# EAGLE schematic schematic_v2 (EAGLE 9.6.2)
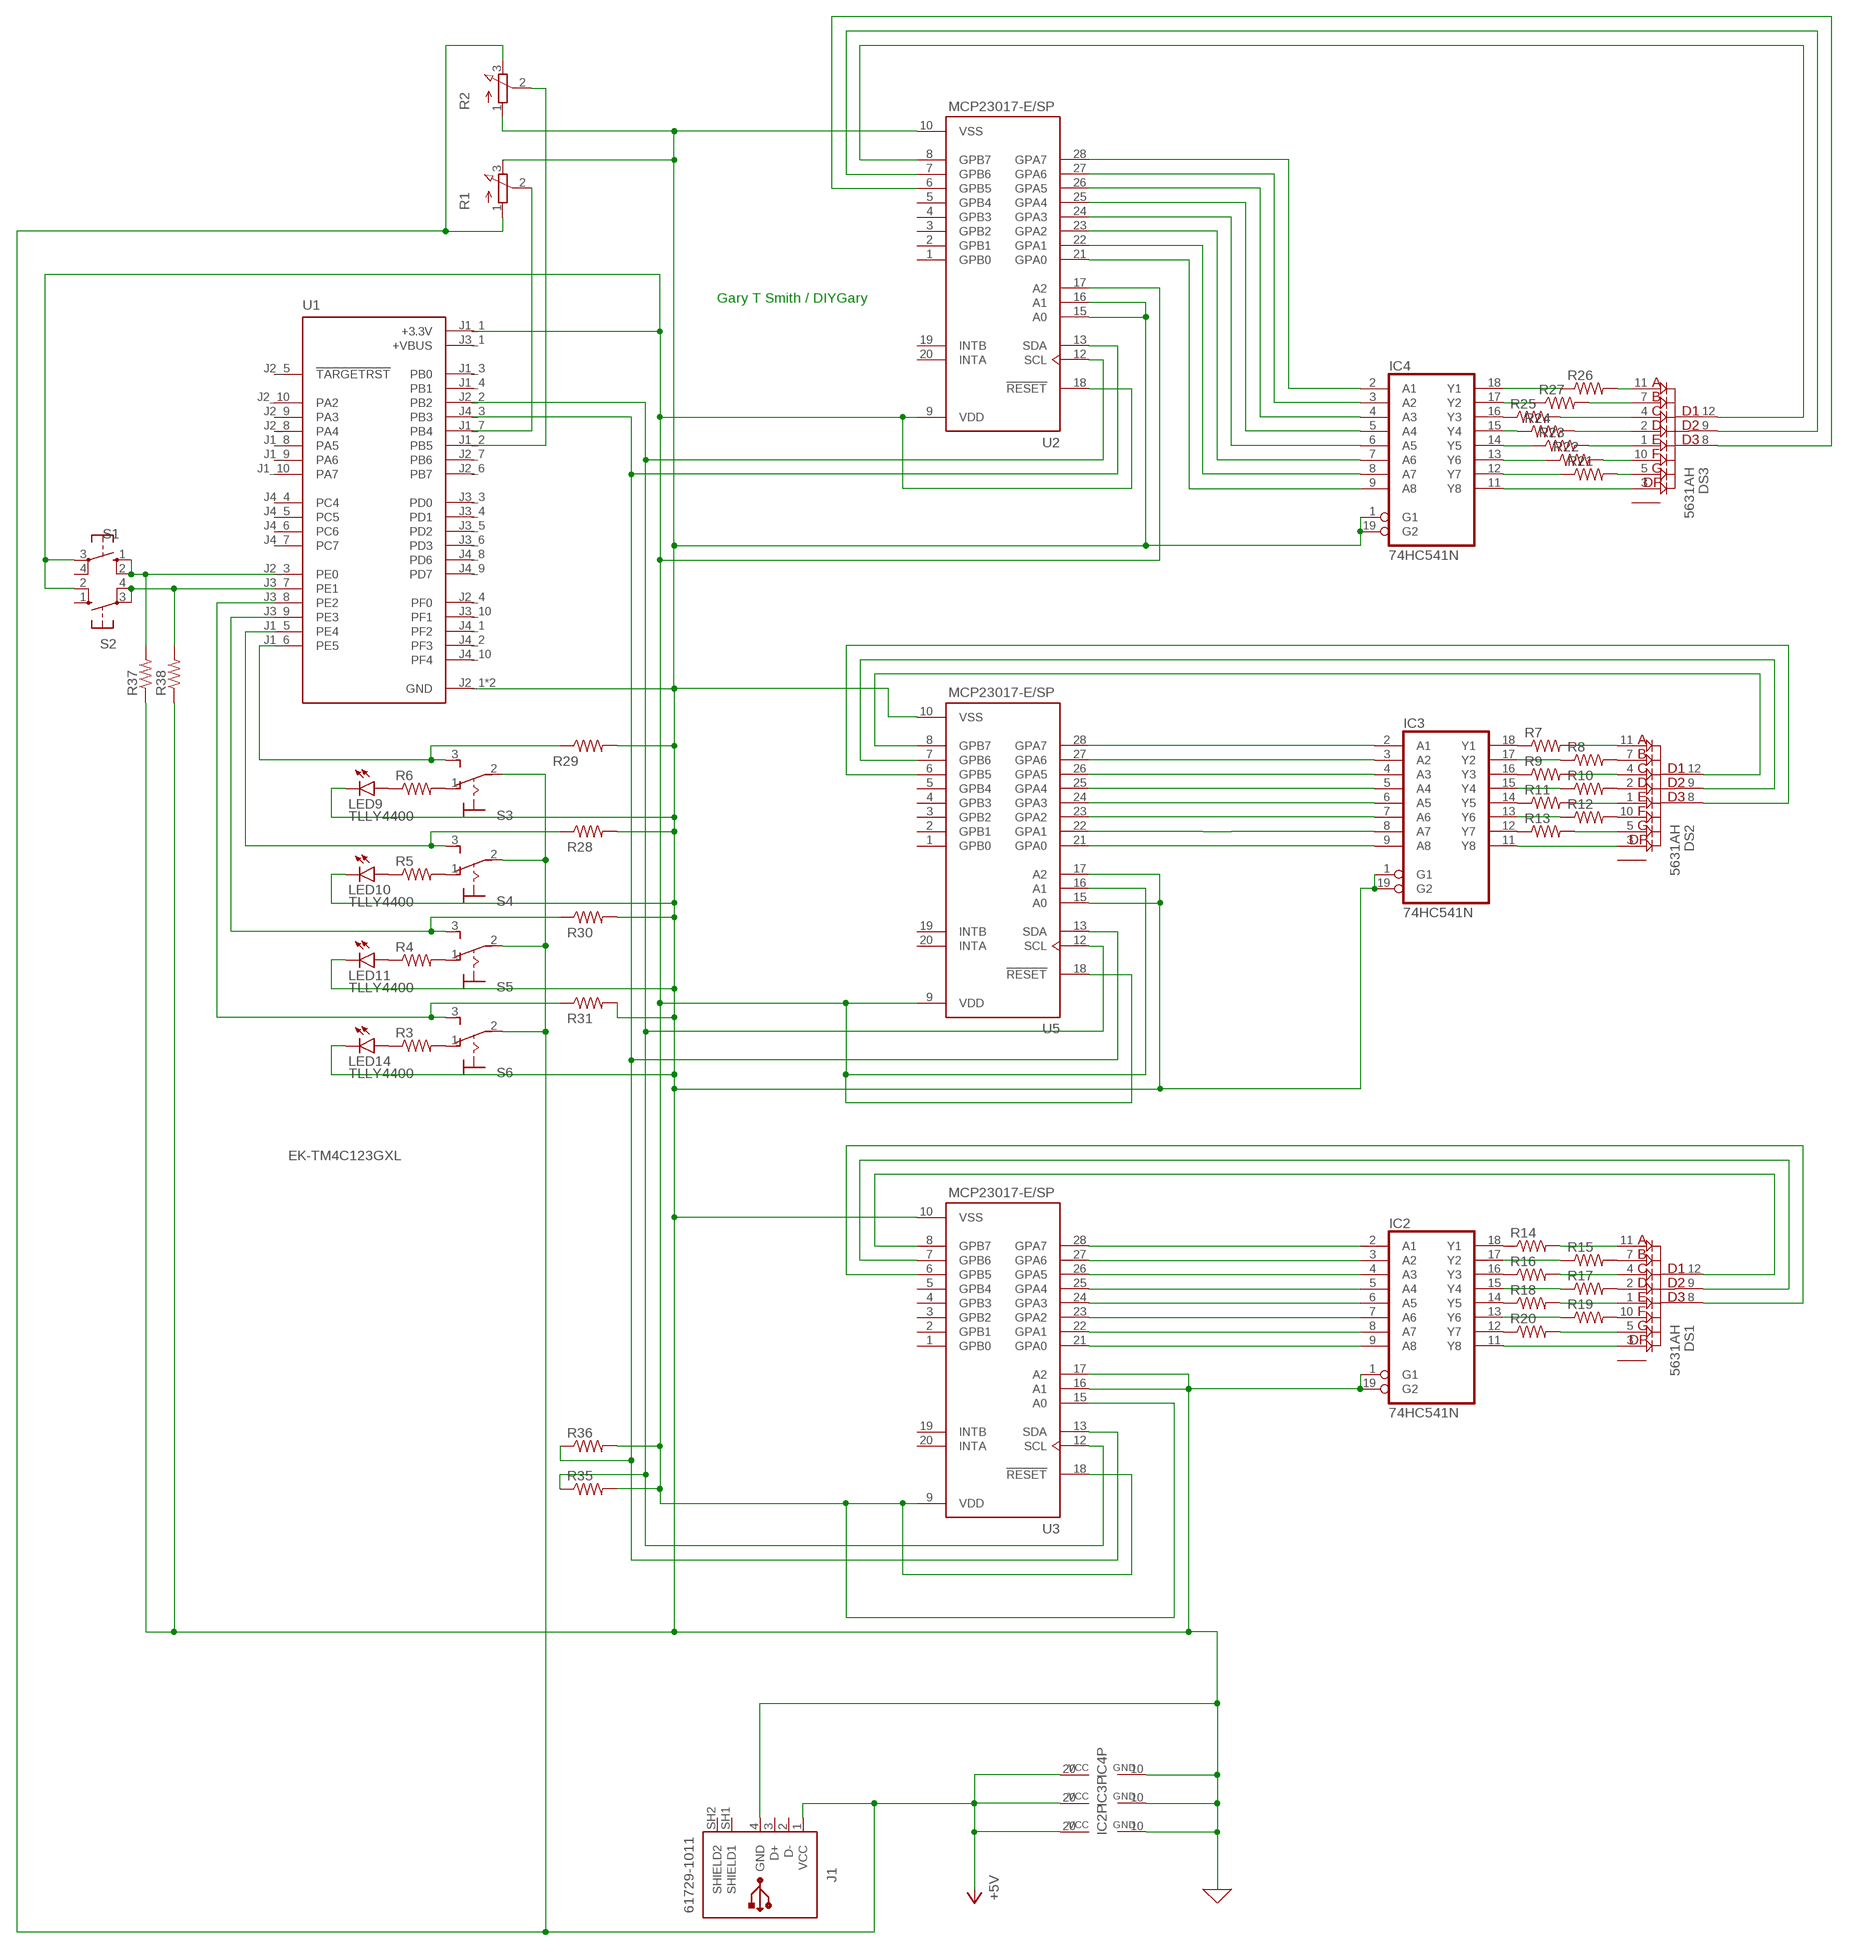
[diagram p0: schematic, sheet 1]

## Parts
DS1  5631AH  [DIPS1524W50P254L3760H835Q12N]
DS2  5631AH  [DIPS1524W50P254L3760H835Q12N]
DS3  5631AH  [DIPS1524W50P254L3760H835Q12N]
IC2  74HC541N  [DIL20]
IC3  74HC541N  [DIL20]
IC4  74HC541N  [DIL20]
J1  61729-1011  [61729-1011BLF]
LED9  TLLY4400  [LED3MM]
LED10  TLLY4400  [LED3MM]
LED11  TLLY4400  [LED3MM]
LED14  TLLY4400  [LED3MM]
R1  3RP/1610N  [3RP/1610N]
R2  3RP/1610N  [3RP/1610N]
R3  R-US_0204/7  [0204/7]
R4  R-US_0204/7  [0204/7]
R5  R-US_0204/7  [0204/7]
R6  R-US_0204/7  [0204/7]
R7  R-US_0204/7  [0204/7]
R8  R-US_0204/7  [0204/7]
R9  R-US_0204/7  [0204/7]
R10  R-US_0204/7  [0204/7]
R11  R-US_0204/7  [0204/7]
R12  R-US_0204/7  [0204/7]
R13  R-US_0204/7  [0204/7]
R14  R-US_0204/7  [0204/7]
R15  R-US_0204/7  [0204/7]
R16  R-US_0204/7  [0204/7]
R17  R-US_0204/7  [0204/7]
R18  R-US_0204/7  [0204/7]
R19  R-US_0204/7  [0204/7]
R20  R-US_0204/7  [0204/7]
R21  R-US_0204/7  [0204/7]
R22  R-US_0204/7  [0204/7]
R23  R-US_0204/7  [0204/7]
R24  R-US_0204/7  [0204/7]
R25  R-US_0204/7  [0204/7]
R26  R-US_0204/7  [0204/7]
R27  R-US_0204/7  [0204/7]
R28  R-US_0204/7  [0204/7]
R29  R-US_0204/7  [0204/7]
R30  R-US_0204/7  [0204/7]
R31  R-US_0204/7  [0204/7]
R35  R-US_0204/7  [0204/7]
R36  R-US_0204/7  [0204/7]
R37  R-US_0204/7  [0204/7]
R38  R-US_0204/7  [0204/7]
S1  10-XX  [B3F-10XX]
S2  10-XX  [B3F-10XX]
S3  320-916  [320-916]
S4  320-916  [320-916]
S5  320-916  [320-916]
S6  320-916  [320-916]
U1  EK-TM4C123GXL  [MODULE_EK-TM4C123GXL]
U2  MCP23017-E/SP  [DIP787W45P254L3556H508Q28]
U3  MCP23017-E/SP  [DIP787W45P254L3556H508Q28]
U5  MCP23017-E/SP  [DIP787W45P254L3556H508Q28]

## Nets
0: IC2.1(G1) IC2.10(GND) IC2.19(G2) IC3.1(G1) IC3.10(GND) IC3.19(G2) IC4.1(G1) IC4.10(GND) IC4.19(G2) J1.4(GND) LED9.K(C) LED10.K(C) LED11.K(C) LED14.K(C) R1.3(E) R2.1(A) R28.2 R29.2 R30.2 R31.2 R37.1 R38.1 U1.J2_1(GND) U1.J3_2(GND) U2.10(VSS) U2.15(A0) U2.16(A1) U3.10(VSS) U3.16(A1) U3.17(A2) U5.10(VSS) U5.15(A0) U5.17(A2) ; supply symbol labelled GND
N$1: DS3.7(A_B) R27.2
N$2: DS1.7(A_B) R15.2
N$3: DS1.2(A_D) R17.2
N$4: DS1.10(A_F) R19.2
N$5: DS2.7(A_B) R8.2
N$6: DS2.2(A_D) R10.2
N$7: DS2.10(A_F) R12.2
N$8: DS3.11(A_A) R26.2
N$9: IC4.18(Y1) R26.1
N$10: R6.2 S3.1(O)
N$11: LED9.A R6.1
N$12: DS3.2(A_D) R24.2
N$13: R5.2 S4.1(O)
N$14: DS3.10(A_F) R22.2
N$15: LED10.A R5.1
N$16: DS3.5(A_G) R21.2
N$17: R4.2 S5.1(O)
N$18: LED11.A R4.1
N$19: R3.2 S6.1(O)
N$20: LED14.A R3.1
N$24: DS3.1(A_E) R23.2
N$27: DS3.3(A_DP) IC4.11(Y8)
N$29: DS3.9(CC_D2) U2.7(GPB6)
N$31: DS3.12(CC_D1) U2.8(GPB7)
N$32: DS3.8(CC_D3) U2.6(GPB5)
N$33: IC4.9(A8) U2.21(GPA0)
N$34: IC4.8(A7) U2.22(GPA1)
N$35: IC4.7(A6) U2.23(GPA2)
N$36: IC4.6(A5) U2.24(GPA3)
N$37: IC4.5(A4) U2.25(GPA4)
N$38: IC4.4(A3) U2.26(GPA5)
N$39: IC4.3(A2) U2.27(GPA6)
N$40: IC4.2(A1) U2.28(GPA7)
N$41: IC3.18(Y1) R7.1
N$42: IC2.20(VCC) IC3.20(VCC) IC4.20(VCC) J1.1(VCC) R1.1(A) R2.3(E) S3.2(P) S4.2(P) S5.2(P) S6.2(P) ; supply symbol labelled +5V
N$43: IC3.16(Y3) R9.1
N$45: IC3.14(Y5) R11.1
N$47: IC3.12(Y7) R13.1
N$48: DS2.3(A_DP) IC3.11(Y8)
N$49: DS2.12(CC_D1) U5.8(GPB7)
N$50: DS2.9(CC_D2) U5.7(GPB6)
N$51: DS2.8(CC_D3) U5.6(GPB5)
N$52: IC3.2(A1) U5.28(GPA7)
N$53: IC3.3(A2) U5.27(GPA6)
N$54: IC3.4(A3) U5.26(GPA5)
N$55: IC3.5(A4) U5.25(GPA4)
N$56: IC3.6(A5) U5.24(GPA3)
N$57: IC3.7(A6) U5.23(GPA2)
N$58: IC3.8(A7) U5.22(GPA1)
N$59: IC3.9(A8) U5.21(GPA0)
N$60: IC2.2(A1) U3.28(GPA7)
N$61: IC2.3(A2) U3.27(GPA6)
N$62: IC2.4(A3) U3.26(GPA5)
N$63: IC2.5(A4) U3.25(GPA4)
N$64: IC2.6(A5) U3.24(GPA3)
N$65: IC2.7(A6) U3.23(GPA2)
N$66: IC2.8(A7) U3.22(GPA1)
N$67: IC2.9(A8) U3.21(GPA0)
N$68: IC2.18(Y1) R14.1
N$70: IC2.16(Y3) R16.1
N$72: IC2.14(Y5) R18.1
N$74: IC2.12(Y7) R20.1
N$75: DS1.3(A_DP) IC2.11(Y8)
N$76: DS1.12(CC_D1) U3.8(GPB7)
N$77: DS1.9(CC_D2) U3.7(GPB6)
N$78: DS1.8(CC_D3) U3.6(GPB5)
N$81: DS1.5(A_G) R20.2
N$87: R29.1 S3.3(S) U1.J1_6(PE5)
N$88: R28.1 S4.3(S) U1.J1_5(PE4)
N$89: R30.1 S5.3(S) U1.J3_9(PE3)
N$90: R31.1 S6.3(S) U1.J3_8(PE2)
N$98: R38.2 S2.3(P) S2.4(P1) U1.J3_7(PE1)
N$99: R37.2 S1.1(S) S1.2(S1) U1.J2_3(PE0)
N$100: R1.2(S) U1.J1_7(PB4)
N$101: R2.2(S) U1.J1_2(PB5)
N$102: R35.1 U1.J2_2(PB2) U2.12(SCL) U3.12(SCL) U5.12(SCL)
N$103: R36.1 U1.J4_3(PB3) U2.13(SDA) U3.13(SDA) U5.13(SDA)
N$104: R35.2 R36.2 S1.3(P) S2.2(S1) U1.J1_1(+3.3V) U2.9(VDD) U2.17(A2) U2.18(!RESET) U3.9(VDD) U3.15(A0) U3.18(!RESET) U5.9(VDD) U5.16(A1) U5.18(!RESET)
N$105: IC2.13(Y6) R19.1
N$106: DS1.1(A_E) R18.2
N$107: IC2.15(Y4) R17.1
N$108: DS1.4(A_C) R16.2
N$109: IC2.17(Y2) R15.1
N$110: DS1.11(A_A) R14.2
N$111: DS2.5(A_G) R13.2
N$112: IC3.13(Y6) R12.1
N$113: DS2.1(A_E) R11.2
N$114: IC3.15(Y4) R10.1
N$115: DS2.4(A_C) R9.2
N$116: IC3.17(Y2) R8.1
N$117: DS2.11(A_A) R7.2
N$120: DS3.4(A_C) R25.2
N$132: IC4.16(Y3) R25.1
N$133: IC4.15(Y4) R24.1
N$134: IC4.14(Y5) R23.1
N$135: IC4.13(Y6) R22.1
N$136: IC4.12(Y7) R21.1
N$138: IC4.17(Y2) R27.1
Unconnected: DS1.6(NC) DS2.6(NC) DS3.6(NC) J1.2(D-) J1.3(D+) J1.SH1(SHIELD1) J1.SH2(SHIELD2) S1.4(P1) S2.1(S) U1.J1_3(PB0) U1.J1_4(PB1) U1.J1_8(PA5) U1.J1_9(PA6) U1.J1_10(PA7) U1.J2_4(PF0) U1.J2_5(!TARGETRST) U1.J2_6(PB7) U1.J2_7(PB6) U1.J2_8(PA4) U1.J2_9(PA3) U1.J2_10(PA2) U1.J3_3(PD0) U1.J3_4(PD1) U1.J3_5(PD2) U1.J3_6(PD3) U1.J3_10(PF1) U1.J4_1(PF2) U1.J4_2(PF3) U1.J4_4(PC4) U1.J4_5(PC5) U1.J4_6(PC6) U1.J4_7(PC7) U1.J4_8(PD6) U1.J4_9(PD7) U1.J4_10(PF4) U2.1(GPB0) U2.2(GPB1) U2.3(GPB2) U2.4(GPB3) U2.5(GPB4) U2.19(INTB) U2.20(INTA) U3.1(GPB0) U3.2(GPB1) U3.3(GPB2) U3.4(GPB3) U3.5(GPB4) U3.19(INTB) U3.20(INTA) U5.1(GPB0) U5.2(GPB1) U5.3(GPB2) U5.4(GPB3) U5.5(GPB4) U5.19(INTB) U5.20(INTA)

## Notes on the sheet
- Gary T Smith / DIYGary

## Power pins joined to a net without a drawn wire
+VBUS: U1.J3_1(+VBUS)

## Library data of the parts
DS1-DS3 = 5631AH:5631AH: LED Displays & Accessories 14mm THREE DIGIT Source: Datasheet <http://www.us.kingbright.com/images/catalog/SPEC/BC56-12SRWA.pdf>; DESCRIPTION: LED Displays & Accessories 14mm THREE DIGIT; HEIGHT: 8.35mm; MANUFACTURER_NAME: Kingbright; MANUFACTURER_PART_NUMBER: BC56-12SRWA; MOUSER_PART_NUMBER: 604-BC56-12SRWA; MOUSER_PRICE-STOCK: https://www.mouser.co.uk/ProductDetail/Kingbright/BC56-12SRWA?qs=VbHzlErGQr623J%252B7XTexpw%3D%3D
IC2-IC4 = 74xx-eu:74*541: Octal BUFFER and LINE DRIVER, 3-state
J1 = Connector_USB:61729-1011: USB(2.0) Type-B, RCPT, 4POS, THT-R/A Datasheet <https://www.amphenol-icc.com/media/wysiwyg/files/drawing/61729.pdf>; CATEGORY: Connector; CONTACTS: 4; CURRENT_RATING: 1A; DESCRIPTION: CONN RCPT USB2.0 TYPEB 4POS R/A; GENDER: Receptacle; MANUFACTURER: Amphenol ICC (FCI); MOUNT_TYPE: R/A; MPN: 61729-1011BLF; OPERATING_TEMP: -55°C to 85°C; PART_STATUS: Active; ROHS_COMPLIANT: RoHS Compliant; SERIES: 61729; SUB-CATEGORY: USB; TYPE: USB-B
LED9-LED11 LED14 = led:TLLY4400: Low Current (2mA) LED 3 mm Tinted Diffused Package color YELLOW Source: Data sheet <http://www.farnell.com/datasheets/391098.pdf>; MF: VISHAY SEMICONDUCTOR; OC_FARNELL: 1612439
R1 R2 = pot:3RP/1610N: 16mm Potentiometer one level Source: http://www.alphapotentiometers.net/html/16mm_pot_2.html
R3-R31 R35-R38 = rcl:R-US_: RESISTOR, American symbol; SPICEPREFIX: R
S1 S2 = switch-omron:10-XX: OMRON SWITCH; MPN: B3F-1000; OC_FARNELL: 176432; OC_NEWARK: 36M3542
S3-S6 = switch:320-916: TOGGLE SWITCH distributor RS Components
U1 = EK-TM4C123GXL:EK-TM4C123GXL: ARM® Cortex®-M4F Based MCU TM4C123G LaunchPad™ Evaluation Kit Check prices <https://pricing.snapeda.com/parts/EK-TM4C123GXL/Texas%20Instruments/view-part?ref=eda>; AVAILABILITY: Warning; DESCRIPTION: ARM® Cortex®-M4F Based MCU TM4C123G LaunchPad™ Evaluation Kit; MF: Texas Instruments; MP: EK-TM4C123GXL; PACKAGE: None; PRICE: None; PURCHASE-URL: https://pricing.snapeda.com/search/part/EK-TM4C123GXL/?ref=eda
U2 U3 U5 = MCP23017-E_SP:MCP23017-E/SP: MCP23017 Series 5.5 V 1.7 MHz SMT 16-Bit I2C I/O Expander - SPDIP-28 Check prices <https://pricing.snapeda.com/parts/MCP23017-E/SP/Microchip%20Technology/view-part?ref=eda>; AVAILABILITY: In Stock; DESCRIPTION: I/O Expander 16 I²C 1.7MHz 28-SPDIP; MF: Microchip Technology; MP: MCP23017-E/SP; PACKAGE: DIP-28 Microchip; PRICE: None